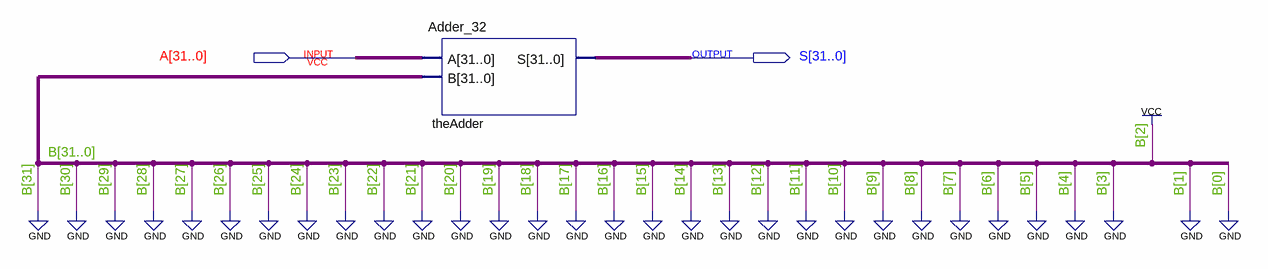
[diagram p0: schematic sheet]
// Quartus schematic INC4_32.bdf as structural Verilog: 1 symbols, 2 pins
module INC4_32 (
  input  [31:0] A,
  output [31:0] S
);

  Adder_32 theAdder (.A(A), .B(32'b00000000000000000000000000000100), .S(S));
endmodule
